# EAGLE design diy-ecg (EAGLE 6.1)
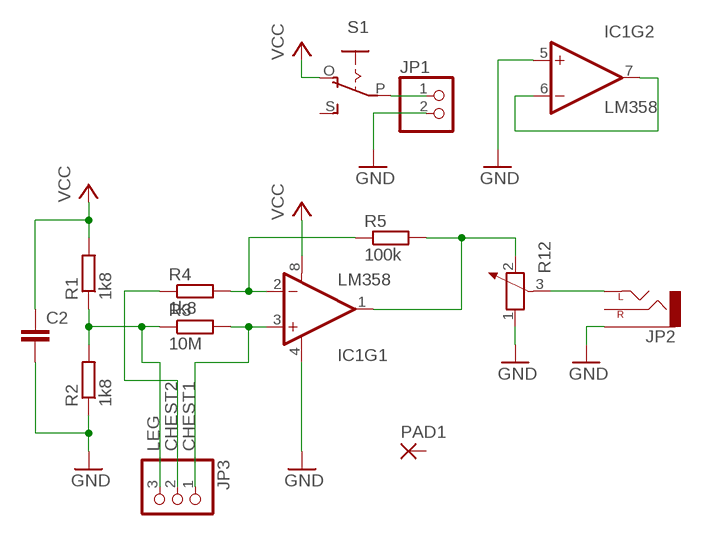
[diagram p0: schematic, sheet 1]

## Parts
C2  C-EU025-025X050  [C025-025X050]
IC1  LM358  [DIP08]
JP1  PINHD-1X2  [1X02]
JP2  AUDIO-JACKPIN-HOLES  [AUDIO-JACK-HOLES]
JP3  PINHD-1X3  [1X03]
PAD1  3,81/1,4  [3,81/1,4]
R1  1k8  R-EU_0204/7  [0204/7]
R2  1k8  R-EU_0204/7  [0204/7]
R3  10M  R-EU_0204/7  [0204/7]
R4  1k8  R-EU_0204/7  [0204/7]
R5  100k  R-EU_0204/7  [0204/7]
R12  POTENTIOMETER_PT-10  [PT-10]
S1  EG1218S  [EG1218]

## Nets
CHEST1: IC1.3(+IN) JP3.1 R3.2
CHEST2: JP3.2 R4.1
GND: C2.2 IC1.4(V-) IC1.5(+IN) JP1.2 JP2.GND(SLEEVE) R2.1 R12.1
LEG: JP3.3 R1.1 R2.2 R3.1
N$1: JP1.1 S1.P
N$2: IC1.1(OUT) R5.2 R12.2
N$3: IC1.2(-IN) R4.2 R5.1
N$4: IC1.6(-IN) IC1.7(OUT)
N$5: JP2.L1-(LEFT) JP2.L2-(LEFT) R12.3
VCC: C2.1 IC1.8(V+) R1.2 S1.O
Unconnected: JP2.R+(RIGHT) PAD1.1(P) S1.S

## Library data of the parts
C2 = rcl:C-EU: CAPACITOR, European symbol
IC1 = SparkFun-AnalogIC:LM358: Jellybean op-amp; PROD_ID: IC-09172
JP1 = pinhead:PINHD-1X2: PIN HEADER
JP2 = _MY_OWN_LIB:AUDIO-JACK: 3.5mm Audio Jack Simple 3.5mm common PCB mount audio jack. SKU: PRT-08032
JP3 = pinhead:PINHD-1X3: PIN HEADER
PAD1 = wirepad:3,81/1,4: THROUGH-HOLE PAD
R1-R5 = rcl:R-EU_: RESISTOR, European symbol
R12 = rcl:POTENTIOMETER_: Potentiometer
S1 = _MY_OWN_LIB:EG1218: SLIDING SWITCH 0.1" spacing through hole, vertical SPDT slide switch http://www.ladyada.net/library/pcb/eaglelibrary.html

## Board
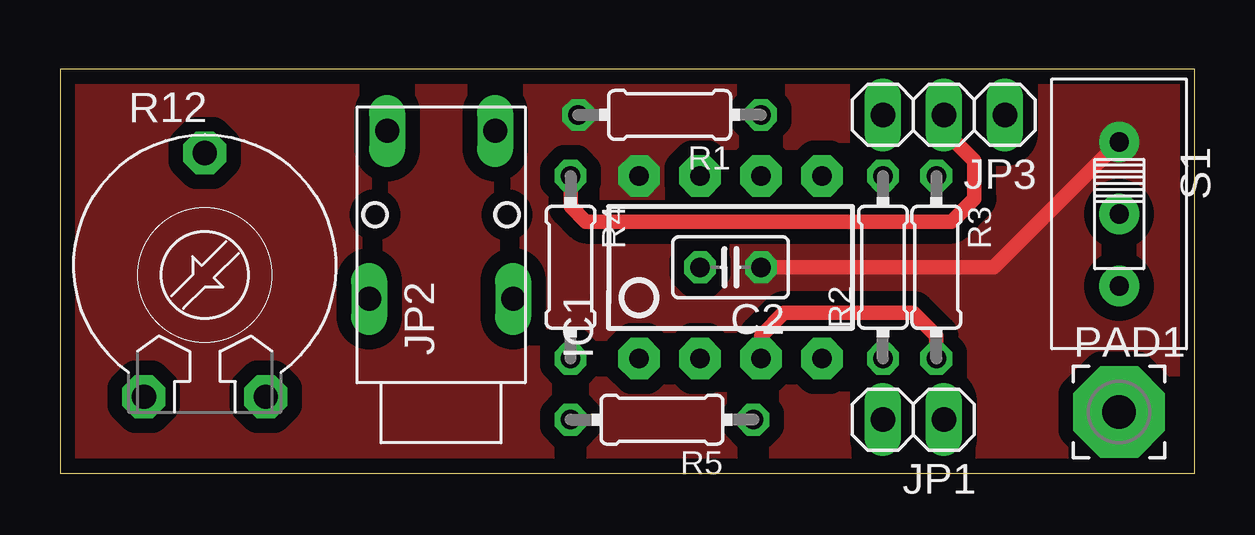
[diagram p1: board, top side]
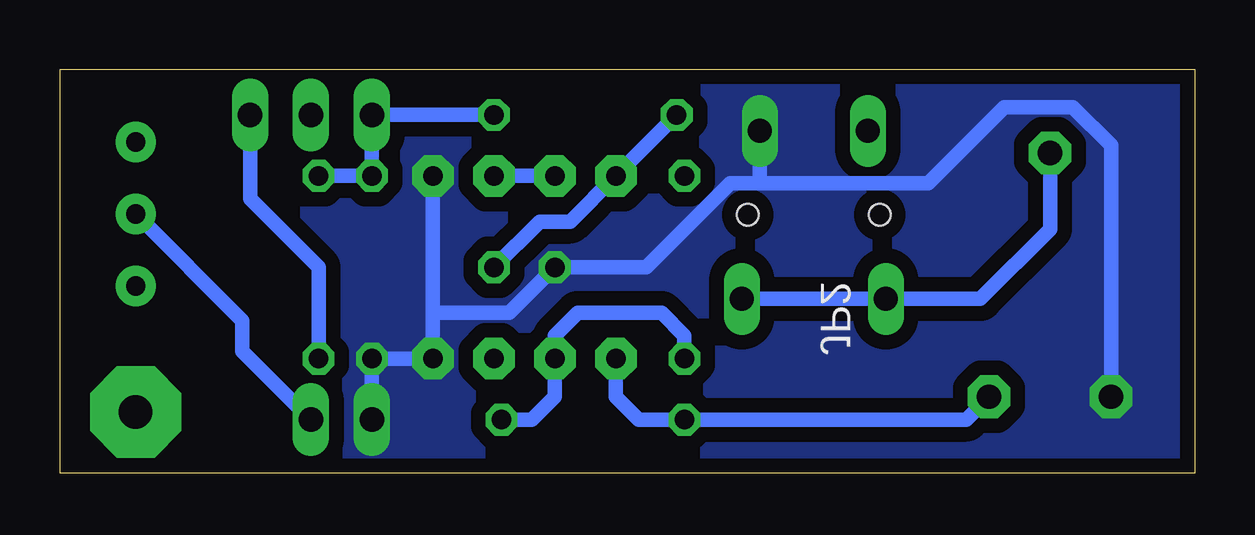
[diagram p2: board, bottom side, seen from below]

Size 47.29 x 16.82 mm. Coordinates in mm from the lower left corner, seen from the top.
Outline: 0,0 47.29,0 47.29,16.82 0,16.82 0,0
Copper layers (1*16): Top 0.035mm / dielectric 1.5mm / Bottom 0.035mm
Design rules: minimum track width 10mil, minimum drill 24mil, track to track 12mil, track to pad 12mil, pad to pad 12mil, via to via 12mil, smd to smd 10mil, copper to edge 12mil, drill to drill 12mil, minimum pad ring 10mil, minimum via ring 10mil, stop-mask expansion 4mil, vias tented up to drill 0mil, thermal gap 12mil

### Footprints (pad centres in the part's own frame; a part is rotated, then mirrored left to right if it is on the bottom)
C025-025X050 = drill 0.813 octagon: 1 -1.27,0; 2 1.27,0
DIP08 = drill 0.813 pad 1.727 octagon: 1 -3.81,-3.81; 2 -1.27,-3.81; 3 1.27,-3.81; 4 3.81,-3.81; 5 3.81,3.81; 6 1.27,3.81; 7 -1.27,3.81; 8 -3.81,3.81
1X02 = drill 1.016 long: 1 -1.27,0; 2 1.27,0
AUDIO-JACK-HOLES = drill 1 pad 1.32 long: GND 6,-2.25; L1- -1,-3; L2- -1,3; R+ 6,2.25 | hole 0.9: 2.5,2.75; 2.5,-2.75
1X03 = drill 1.016 long: 1 -2.54,0; 2 0,0; 3 2.54,0
3,81/1,4 = drill 1.397 pad 3.81 octagon: 1 0,0
0204/7 = drill 0.813 octagon: 1 -3.81,0; 2 3.81,0
PT-10 = drill 1.016 pad 1.778 octagon: 1 -2.54,-5.08; 2 2.54,-5.08; 3 0,5.08
EG1218 = drill 0.8 pad 1.676: O -3,0; P 0,0; S 3,0

### Placement (x,y rotation side)
C2  27.94,8.57 180 top
IC1  27.94,8.57 0 top
JP1  35.56,2.22 180 top
JP2  15.88,8.26 90 top
JP3  36.83,14.92 180 top
PAD1  44.13,2.54 0 top
R1  25.4,14.92 180 top
R2  34.29,8.57 90 top
R3  36.51,8.57 270 top
R4  21.27,8.57 270 top
R5  25.08,2.22 180 top
R12  6.03,8.26 0 top
S1  44.13,10.79 270 top

### Tracks (layer width: path | path; a pad name or v marks a point on that pad's centre or on a via)
CHEST1
  Top 0.61: IC1.3 29.21,5.71 30.16,6.67 35.56,6.67 36.51,5.71 R3.2
  Bottom 0.61: R3.2 36.51,8.57 39.37,11.43 JP3.1
CHEST2
  Top 0.61: JP3.2 36.83,14.29 38.1,13.02 38.1,11.43 37.15,10.48 21.91,10.48 21.27,11.11 R4.1
GND
  Bottom 0.61: JP1.2 R2.1 IC1.4 31.75,6.67 | 31.75,6.67 IC1.5 | 31.75,6.67 28.57,6.67 C2.2 22.86,8.57 19.37,12.06 18.1,12.06 | 18.1,12.06 11.11,12.06 7.94,15.24 5.08,15.24 3.49,13.65 R12.1 | JP2.GND 18.12,12.09 18.1,12.06
  pour Bottom (isolate 0.61, no thermals): 0,0 47.31,0 47.31,16.83 0,16.83
LEG
  Bottom 0.61: R1.1 JP3.3 R2.2 R3.1
N$1
  Bottom 0.61: S1.P 39.69,6.35 39.69,5.08 JP1.1
N$2
  Bottom 0.61: IC1.1 24.13,3.17 23.18,2.22 R5.2 9.53,2.22 R12.2
N$3
  Bottom 0.61: R5.1 27.62,2.22 26.67,3.17 IC1.2 26.67,5.71 25.72,6.67 22.23,6.67 21.27,5.71 R4.2
N$4
  Bottom 0.61: IC1.7 IC1.6
N$5
  Bottom 0.61: JP2.L1- JP2.L2- 8.94,7.25 6.03,10.16 R12.3
VCC
  Top 0.61: C2.1 38.91,8.57 S1.O
  Bottom 0.61: C2.1 27.3,10.48 26.04,10.48 IC1.8 R1.2
  pour Top (isolate 0.61, no thermals): 0,16.83 47.31,16.83 47.31,0 0,0